# Altium schematic sheet LED_ARRAY.SchDoc
size B; SheetNumber: 3; SheetTotal: 5
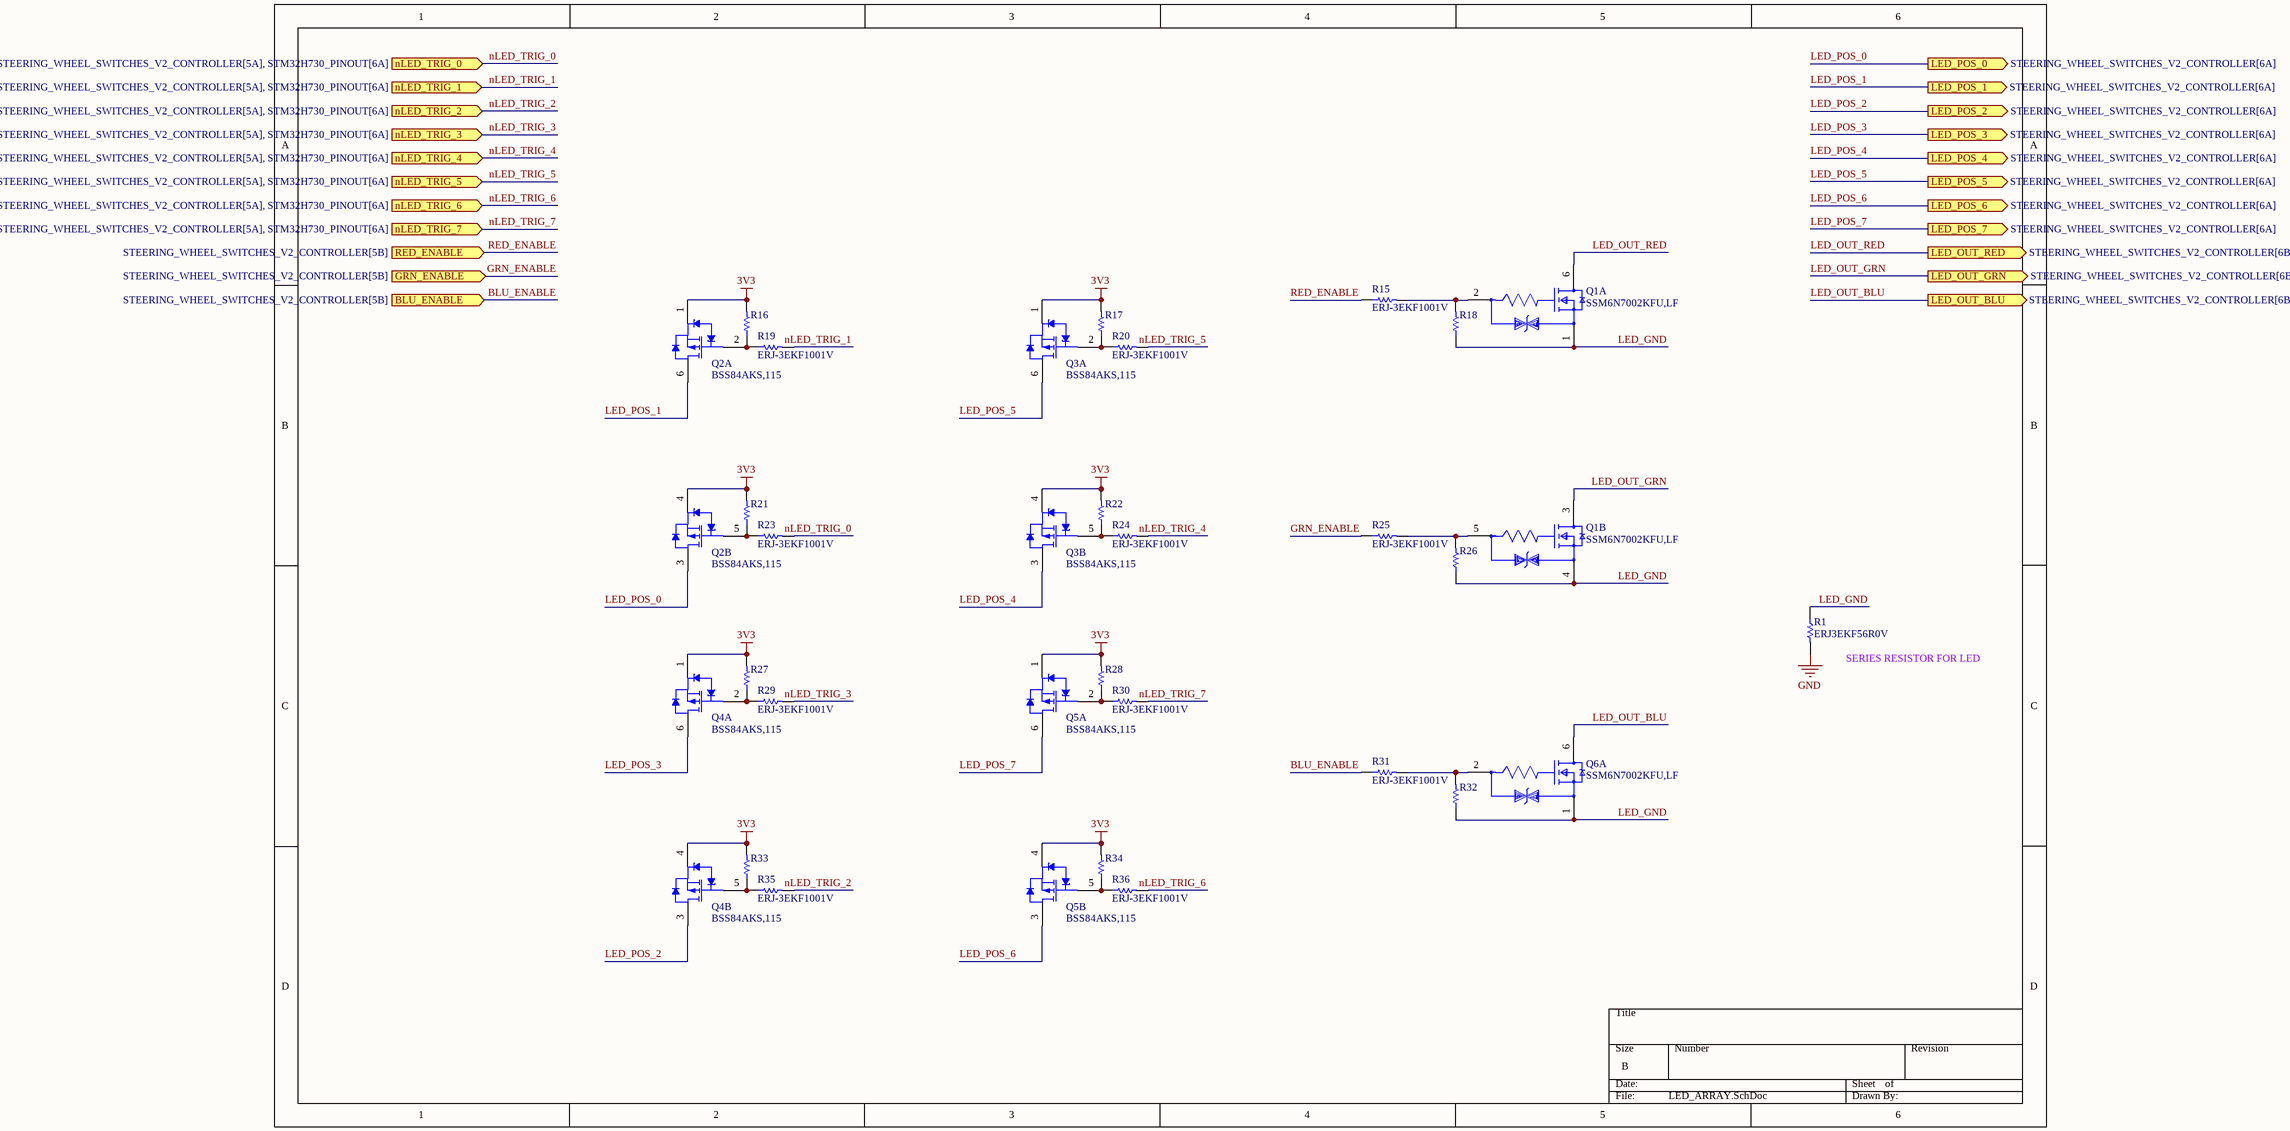
[diagram p0: LED_ARRAY.SchDoc]

## Parts
Q1  SSM6N7002KFU,LF  [FP-SSOP6-P-0_65A-MFG]  (parts A,B of 2)
Q2  BSS84AKS,115  [NXP-SOT363_L]  (parts A,B of 2)
Q3  BSS84AKS,115  [NXP-SOT363_L]  (parts A,B of 2)
Q4  BSS84AKS,115  [NXP-SOT363_L]  (parts A,B of 2)
Q5  BSS84AKS,115  [NXP-SOT363_L]  (parts A,B of 2)
Q6  SSM6N7002KFU,LF  [FP-SSOP6-P-0_65A-MFG]  (part A of 2)
R1  ERJ3EKF56R0V  [RESC1608X55X30NL15T15]
R15  ERJ-3EKF1001V  [RESC1608X55X30LL15T15]
R16  ERJ3EKF1002V  [RESC1609X55X30LL15T15]  (value not drawn)
R17  ERJ3EKF1002V  [RESC1609X55X30LL15T15]  (value not drawn)
R18  ERJ3EKF1002V  [RESC1609X55X30LL15T15]  (value not drawn)
R19  ERJ-3EKF1001V  [RESC1608X55X30LL15T15]
R20  ERJ-3EKF1001V  [RESC1608X55X30LL15T15]
R21  ERJ3EKF1002V  [RESC1609X55X30LL15T15]  (value not drawn)
R22  ERJ3EKF1002V  [RESC1609X55X30LL15T15]  (value not drawn)
R23  ERJ-3EKF1001V  [RESC1608X55X30LL15T15]
R24  ERJ-3EKF1001V  [RESC1608X55X30LL15T15]
R25  ERJ-3EKF1001V  [RESC1608X55X30LL15T15]
R26  ERJ3EKF1002V  [RESC1609X55X30LL15T15]  (value not drawn)
R27  ERJ3EKF1002V  [RESC1609X55X30LL15T15]  (value not drawn)
R28  ERJ3EKF1002V  [RESC1609X55X30LL15T15]  (value not drawn)
R29  ERJ-3EKF1001V  [RESC1608X55X30LL15T15]
R30  ERJ-3EKF1001V  [RESC1608X55X30LL15T15]
R31  ERJ-3EKF1001V  [RESC1608X55X30LL15T15]
R32  ERJ3EKF1002V  [RESC1609X55X30LL15T15]  (value not drawn)
R33  ERJ3EKF1002V  [RESC1609X55X30LL15T15]  (value not drawn)
R34  ERJ3EKF1002V  [RESC1609X55X30LL15T15]  (value not drawn)
R35  ERJ-3EKF1001V  [RESC1608X55X30LL15T15]
R36  ERJ-3EKF1001V  [RESC1608X55X30LL15T15]

## Ports
BLU_ENABLE (in, see STEERING_WHEEL_SWITCHES_V2_CONTROLLER[5B]), GRN_ENABLE (in, see STEERING_WHEEL_SWITCHES_V2_CONTROLLER[5B]), LED_OUT_BLU (out, see STEERING_WHEEL_SWITCHES_V2_CONTROLLER[6B]), LED_OUT_GRN (out, see STEERING_WHEEL_SWITCHES_V2_CONTROLLER[6B]), LED_OUT_RED (out, see STEERING_WHEEL_SWITCHES_V2_CONTROLLER[6B]), LED_POS_0 (out, see STEERING_WHEEL_SWITCHES_V2_CONTROLLER[6A]), LED_POS_1 (out, see STEERING_WHEEL_SWITCHES_V2_CONTROLLER[6A]), LED_POS_2 (out, see STEERING_WHEEL_SWITCHES_V2_CONTROLLER[6A]), LED_POS_3 (out, see STEERING_WHEEL_SWITCHES_V2_CONTROLLER[6A]), LED_POS_4 (out, see STEERING_WHEEL_SWITCHES_V2_CONTROLLER[6A]), LED_POS_5 (out, see STEERING_WHEEL_SWITCHES_V2_CONTROLLER[6A]), LED_POS_6 (out, see STEERING_WHEEL_SWITCHES_V2_CONTROLLER[6A]), LED_POS_7 (out, see STEERING_WHEEL_SWITCHES_V2_CONTROLLER[6A]), nLED_TRIG_0 (in, see STEERING_WHEEL_SWITCHES_V2_CONTROLLER[5A], STM32H730_PINOUT[6A]), nLED_TRIG_1 (in, see STEERING_WHEEL_SWITCHES_V2_CONTROLLER[5A], STM32H730_PINOUT[6A]), nLED_TRIG_2 (in, see STEERING_WHEEL_SWITCHES_V2_CONTROLLER[5A], STM32H730_PINOUT[6A]), nLED_TRIG_3 (in, see STEERING_WHEEL_SWITCHES_V2_CONTROLLER[5A], STM32H730_PINOUT[6A]), nLED_TRIG_4 (in, see STEERING_WHEEL_SWITCHES_V2_CONTROLLER[5A], STM32H730_PINOUT[6A]), nLED_TRIG_5 (in, see STEERING_WHEEL_SWITCHES_V2_CONTROLLER[5A], STM32H730_PINOUT[6A]), nLED_TRIG_6 (in, see STEERING_WHEEL_SWITCHES_V2_CONTROLLER[5A], STM32H730_PINOUT[6A]), nLED_TRIG_7 (in, see STEERING_WHEEL_SWITCHES_V2_CONTROLLER[5A], STM32H730_PINOUT[6A]), RED_ENABLE (in, see STEERING_WHEEL_SWITCHES_V2_CONTROLLER[5B])

## Nets
3V3: Q2.1(S1) Q2.4(S2) Q3.1(S1) Q3.4(S2) Q4.1(S1) Q4.4(S2) Q5.1(S1) Q5.4(S2) R16.2 R17.2 R21.2 R22.2 R27.2 R28.2 R33.2 R34.2
GND: R1.2
BLU_ENABLE: R31.1 ; port BLU_ENABLE
GRN_ENABLE: R25.1 ; port GRN_ENABLE
LED_GND: Q1.1(Source1) Q1.4(Source2) Q6.1(Source1) R1.1 R18.1 R26.1 R32.1
LED_OUT_BLU: Q6.6(Drain1) ; port LED_OUT_BLU
LED_OUT_GRN: Q1.3(Drain2) ; port LED_OUT_GRN
LED_OUT_RED: Q1.6(Drain1) ; port LED_OUT_RED
LED_POS_0: Q2.3(D2) ; port LED_POS_0
LED_POS_1: Q2.6(D1) ; port LED_POS_1
LED_POS_2: Q4.3(D2) ; port LED_POS_2
LED_POS_3: Q4.6(D1) ; port LED_POS_3
LED_POS_4: Q3.3(D2) ; port LED_POS_4
LED_POS_5: Q3.6(D1) ; port LED_POS_5
LED_POS_6: Q5.3(D2) ; port LED_POS_6
LED_POS_7: Q5.6(D1) ; port LED_POS_7
nLED_TRIG_0: R23.2 ; port nLED_TRIG_0
nLED_TRIG_1: R19.2 ; port nLED_TRIG_1
nLED_TRIG_2: R35.2 ; port nLED_TRIG_2
nLED_TRIG_3: R29.2 ; port nLED_TRIG_3
nLED_TRIG_4: R24.2 ; port nLED_TRIG_4
nLED_TRIG_5: R20.2 ; port nLED_TRIG_5
nLED_TRIG_6: R36.2 ; port nLED_TRIG_6
nLED_TRIG_7: R30.2 ; port nLED_TRIG_7
RED_ENABLE: R15.1 ; port RED_ENABLE
NetQ1_2: Q1.2(Gate1) R15.2 R18.2
NetQ1_5: Q1.5(Gate2) R25.2 R26.2
NetQ2_2: Q2.2(G1) R16.1 R19.1
NetQ2_5: Q2.5(G2) R21.1 R23.1
NetQ3_2: Q3.2(G1) R17.1 R20.1
NetQ3_5: Q3.5(G2) R22.1 R24.1
NetQ4_2: Q4.2(G1) R27.1 R29.1
NetQ4_5: Q4.5(G2) R33.1 R35.1
NetQ5_2: Q5.2(G1) R28.1 R30.1
NetQ5_5: Q5.5(G2) R34.1 R36.1
NetQ6_2: Q6.2(Gate1) R31.2 R32.2

## Notes on the sheet
- (near R1) SERIES RESISTOR FOR LED

## Library data of the parts
Q1 Q6 = CMP-35916-000009-1: MOSFET 2N-CH 60V 0.3A; Input Capacitance: 40pF; Continuous Drain Current (ID): 300mA; Max Power Dissipation: 285mW; FET Type: 2 N-Channel; Rds On Max: 1.5R; Mount: Surface Mount; Drain to Source Voltage (Vdss): 60V; Packaging: Tape and Reel
Q2-Q5 = CMP-1259-00116-1: Dual P-Channel Trench MOSFET, -50 V, -0.16 A, -55 to 150 degC, 6-Pin SOT363, Tape and Reel; Manufacturer: NXP Semiconductors; VGSth [typ] (V): -1.6; Automotive Qualified: Y; Channel Type: P; IDM [max] (A): -0.64; Packing: Tape & Reel; Mounting Technology: Surface Mount; PackageDescription: 6-Pin Small Outline Transistor Package, Body 2 x 1.25 mm, Pitch 0.65 mm; ComponentLink2URL: http://www.nxp.com/documents/data_sheet/BSS84AKS.pdf; ComponentLink3URL: http://www.nxp.com/documents/outline_drawing/sot363_po.pdf; PartNumber: BSS84AKS,115; PackageReference: SOT363; PackageVersion: 06-03-16, 03/2006; ComponentLink3Description: Package Specification; ComponentLink2Description: Datasheet; ComponentLink1Description: Manufacturer URL; VDS [max] (V): -50; Code_JEITA: SC-88; ID [max] (A): -0.16; DatasheetVersion: Rev. 1; ComponentLink1URL: http://www.nxp.com/
R1 = CMP-2000-00572-1: Manufacturer: Panasonic; Part Number: ERJ3EKF56R0V
R15 R19 R20 R23-R25 R29-R31 R35 R36 = CMP-2000-00180-1: Manufacturer: Panasonic; Part Number: ERJ-3EKF1001V
R16-R18 R21 R22 R26-R28 R32-R34 = CMP-1012-00623-3: Chip Resistor, 10 KOhm, +/- 1%, 0.1 W, -55 to 155 degC, 0603 (1608 Metric), RoHS, Tape and Reel; Manufacturer: Panasonic; Voltage Rating: 75V; Case\/Package: 0603; Power Rating: 100mW; Resistance: 10KOhm; Temperature Coefficient: 100ppm\/degreesC; Number of Pins: 2; Package Reference: 603; Depth: 0.8mm; Mount: SurfaceMount; Package Description: 2-Pin Surface Mount Device, Body 1.6 x 0.85 mm; Datasheet Version: 02/2017; Length: 1.6mm; Lead Free: LeadFree; Height: 0.45mm; Number of Terminations: 2; Max Power Dissipation: 100mW; Min Operating Temperature: -55degC; Datasheet URL: https://industrial.panasonic.com/cdbs/www-data/pdf/RDA0000/AOA0000C304.pdf; Termination: SMD/SMT; Case Code (Metric): 1608; Case Code (Imperial): 0603; Tolerance: 1%; Max Operating Temperature: 155degC; RoHSCompliant: true; Voltage Rating (DC): 75V; Radiation Hardening: No; Packaging: TapeandReel; Composition: ThickFilm; Mounting Technology: SurfaceMount; Manufacturer URL: http://www.panasonic.com/; Width: 0.031inch; REACH SVHC: NoSVHC; Contact Plating: Tin; Military Standard: Not; Package Quantity: 1